# EAGLE design automatic_Slider_door_2 (EAGLE 9.6.2)
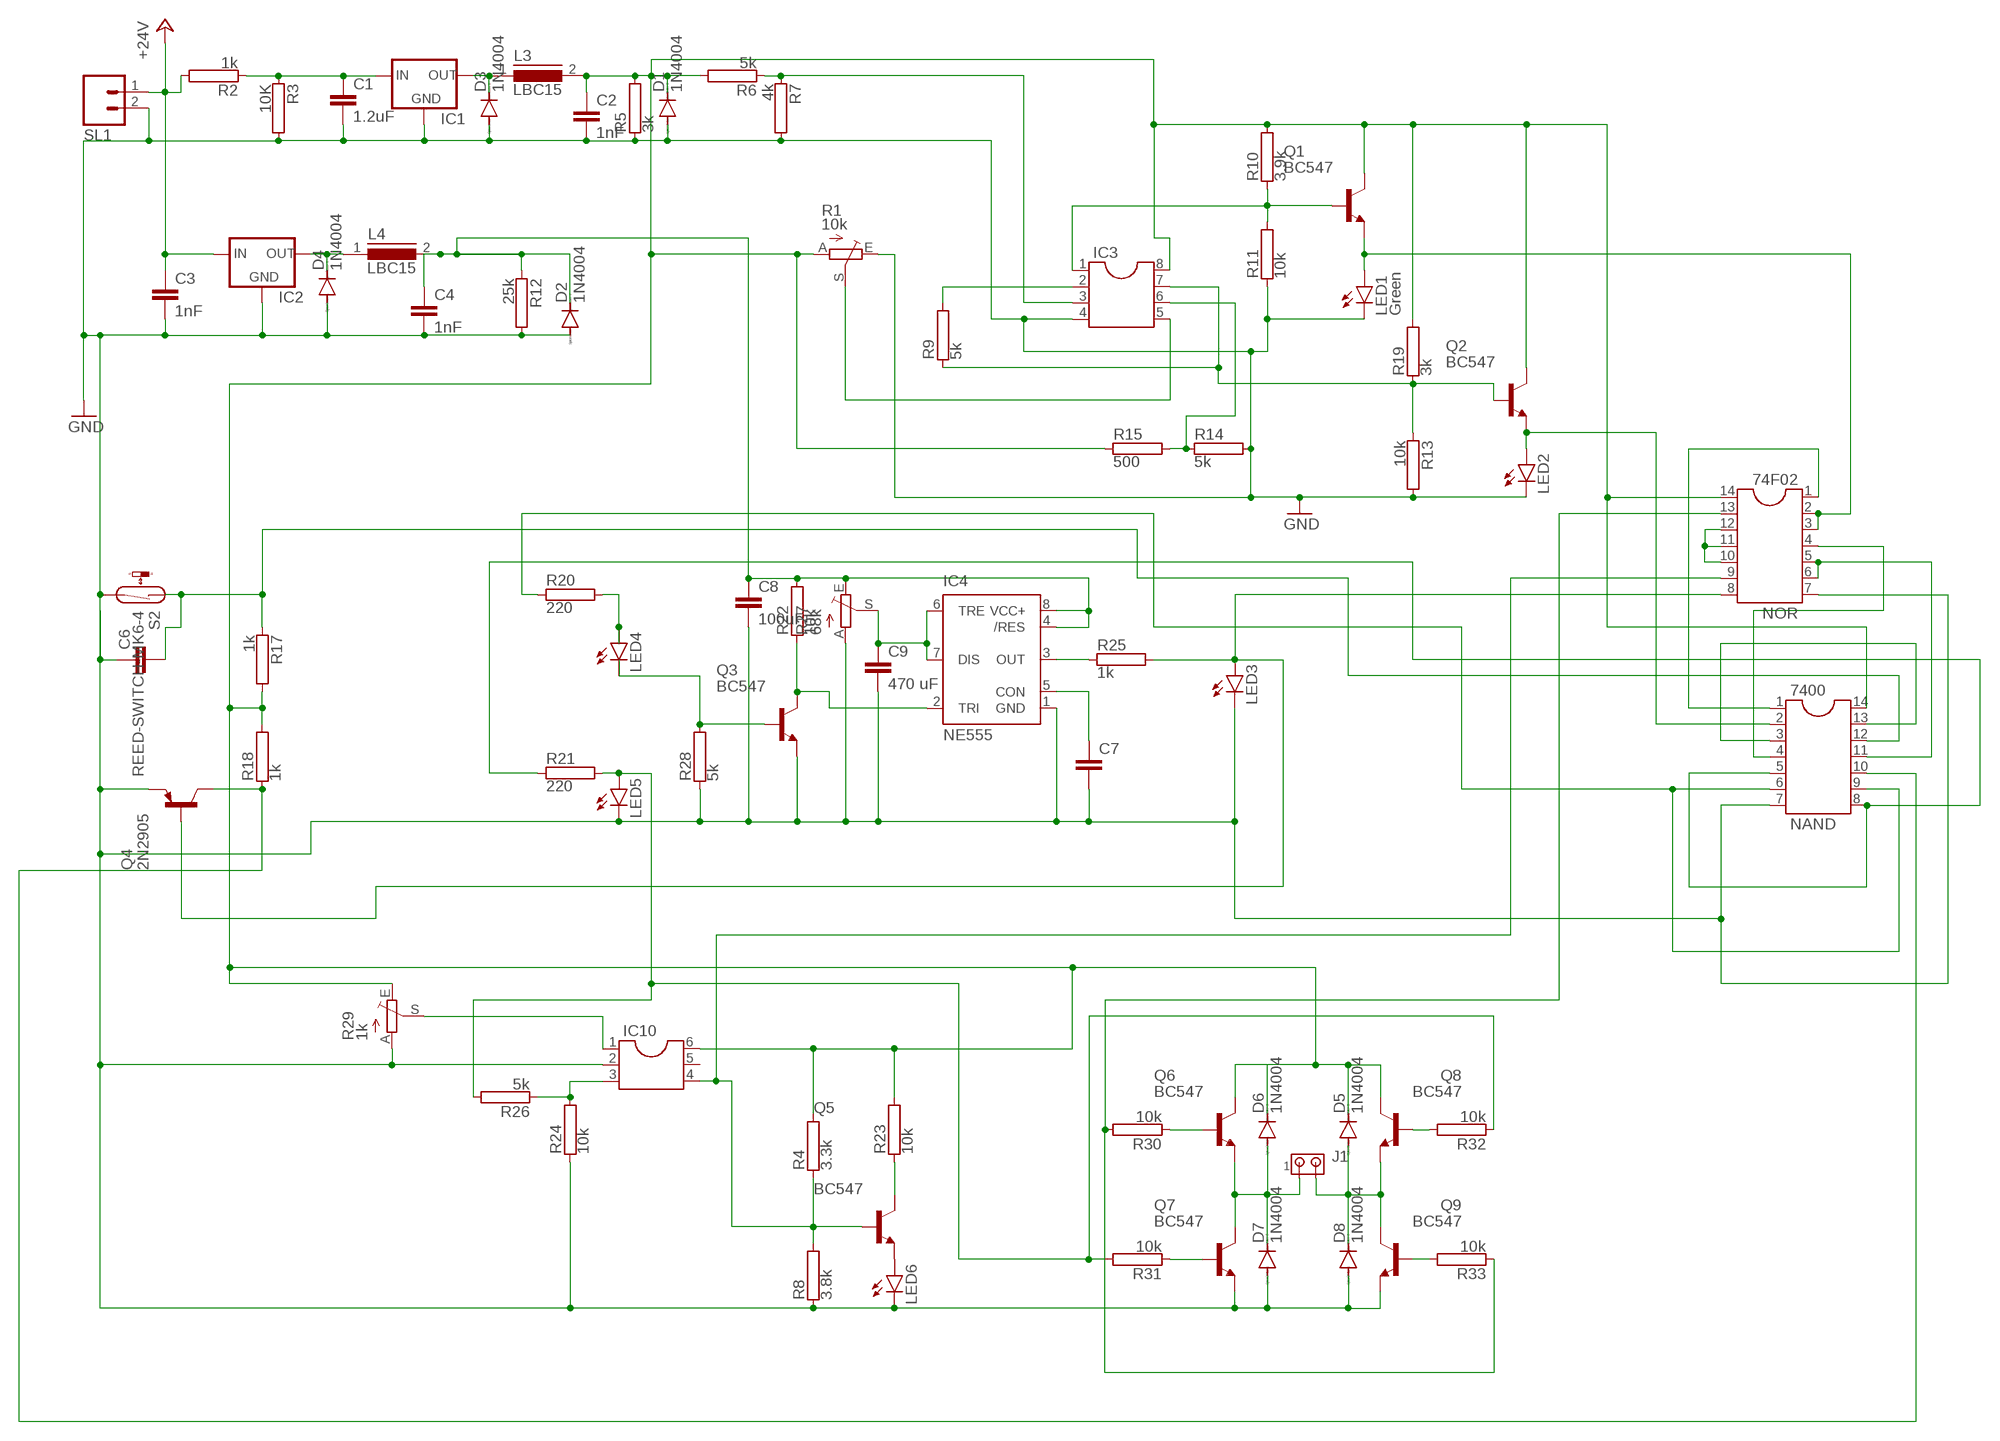
[diagram p0: schematic, sheet 1]

## Parts
74F02  NOR  DIL14  [DIL14]
7400  NAND  DIL14  [DIL14]
C1  1.2uF  C2,5-3  [C2.5-3]
C2  1nF  C2,5-3  [C2.5-3]
C3  1nF  C2,5-3  [C2.5-3]
C4  1nF  C2,5-3  [C2.5-3]
C6  C2,5-3  [C2.5-3]
C7  C2,5-3  [C2.5-3]
C8  100uF  C2,5-3  [C2.5-3]
C9  470 uF  C2,5-3  [C2.5-3]
D1  1N4004  [DO41-10]
D2  1N4004  [DO41-10]
D3  1N4004  [DO41-10]
D4  1N4004  [DO41-10]
D5  1N4004  [DO41-10]
D6  1N4004  [DO41-10]
D7  1N4004  [DO41-10]
D8  1N4004  [DO41-10]
IC1  78LXX  [78LXX]
IC2  78LXX  [78LXX]
IC3  DIL8S  [SOCKET-08]
IC4  NE555  [DIL-08]
IC10  DIL6S  [SOCKET-06]
J1  MTA02-156  [1X2MTA]
L3  LBC15  [LBC15]
L4  LBC15  [LBC15]
LED1  Green  LEDB152  [Q62902-B152]
LED2  LEDB152  [Q62902-B152]
LED3  LEDB152  [Q62902-B152]
LED4  LEDB152  [Q62902-B152]
LED5  LEDB152  [Q62902-B152]
LED6  LEDB152  [Q62902-B152]
Q1  BC547  [TO92]
Q2  BC547  [TO92]
Q3  BC547  [TO92]
Q4  2N2905  [TO5]
Q5  BC547  [TO92]
Q6  BC547  [TO92]
Q7  BC547  [TO92]
Q8  BC547  [TO92]
Q9  BC547  [TO92]
R1  10k  TRIM_EU-S75P  [S75P]
R2  1k  RCA0001  [CA0001]
R3  10K  RCA0001  [CA0001]
R4  3.3k  RCA0001  [CA0001]
R5  3k  RCA0001  [CA0001]
R6  5k  RCA0001  [CA0001]
R7  4k  RCA0001  [CA0001]
R8  3.8k  RCA0001  [CA0001]
R9  5k  RCA0001  [CA0001]
R10  3.9k  RCA0001  [CA0001]
R11  10k  RCA0001  [CA0001]
R12  25k  RCA0001  [CA0001]
R13  10k  RCA0001  [CA0001]
R14  5k  RCA0001  [CA0001]
R15  500  RCA0001  [CA0001]
R17  1k  RCA0001  [CA0001]
R18  1k  RCA0001  [CA0001]
R19  3k  RCA0001  [CA0001]
R20  220  RCA0001  [CA0001]
R21  220  RCA0001  [CA0001]
R22  10k  RCA0001  [CA0001]
R23  10k  RCA0001  [CA0001]
R24  10k  RCA0001  [CA0001]
R25  1k  RCA0001  [CA0001]
R26  5k  RCA0001  [CA0001]
R27  68k  TRIM_EU-S75P  [S75P]
R28  5k  RCA0001  [CA0001]
R29  1k  TRIM_EU-S75P  [S75P]
R30  10k  RCA0001  [CA0001]
R31  10k  RCA0001  [CA0001]
R32  10k  RCA0001  [CA0001]
R33  10k  RCA0001  [CA0001]
S2  REED-SWITCH-MK6-4  [MK6-4]
SL1  MA02  [02PA]

## Nets
+24V: C3.1 IC2.IN R2.2 SL1.1
GND: 74F02.7 7400.7 C1.2 C2.2 C3.2 C4.2 C6.1 C7.2 C8.2 C9.2 D1.A D2.A D3.A D4.A D7.A D8.A IC1.GND IC2.GND IC3.4 IC4.1(GND) IC10.2 LED1.K(C) LED2.K(C) LED3.K(C) LED5.K(C) LED6.K(C) Q3.1(E) Q4.1(E) Q7.1(E) Q9.1(E) R1.E R3.2 R5.1 R7.2 R8.1 R11.1 R12.2 R13.2 R14.2 R24.1 R27.A R28.1 R29.A S2.2 SL1.2
N$1: IC3.5 R1.S
N$2: C1.1 IC1.IN R2.1 R3.1
N$3: 7400.2 LED2.A Q2.1(E)
N$4: D3.C IC1.OUT L3.1
N$5: 7400.5 7400.8 R21.1
N$6: IC3.2 R9.2
N$7: IC3.6 R14.1 R15.2
N$8: IC3.7 Q2.2(B) R9.1 R13.1 R19.1
N$9: IC3.3 R6.1 R7.1
N$10: IC3.1 Q1.2(B) R10.1 R11.2
N$11: 7400.3 7400.13
N$14: 74F02.9 IC10.4 Q5.2(B) R4.1 R8.2
N$15: IC4.3(OUT) R25.1
N$16: Q9.2(B) R33.2
N$17: 7400.12 C6.2 R17.1 S2.1
N$18: 74F02.2 74F02.3 LED1.A Q1.1(E)
N$19: 74F02.5 74F02.6 7400.11
N$20: IC10.3 R24.2 R26.1
N$21: LED4.A R20.2
N$22: 7400.10 Q4.3(C) R18.1
N$23: LED6.A Q5.1(E)
N$24: C4.1 C8.1 D2.C IC4.4(/RES) IC4.8(VCC+) L4.2 R12.1 R22.2 R27.E
N$25: LED5.A R21.2 R26.2 R31.2 R32.1
N$26: C9.1 IC4.6(TRE) IC4.7(DIS) R27.S
N$27: IC4.2(TRI) Q3.3(C) R22.1
N$28: 74F02.4 7400.4
N$29: IC10.1 R29.S
N$30: 74F02.8 LED3.A Q4.2(B) R25.2
N$31: C7.1 IC4.5(CON)
N$32: LED4.K(C) Q3.2(B) R28.2
N$33: 74F02.10 74F02.11 74F02.12
N$35: 7400.6 7400.9 R20.1
N$38: 74F02.1 7400.1
N$39: D4.C IC2.OUT L4.1
N$40: 74F02.13 R30.2 R33.1
N$41: D6.A D7.C J1.1 Q6.1(E) Q7.3(C)
N$42: Q8.2(B) R32.2
N$43: 74F02.14 7400.14 C2.1 D1.C D5.C D6.C IC3.8 IC10.6 L3.2 Q1.3(C) Q2.3(C) Q6.3(C) Q8.3(C) R1.A R4.2 R5.2 R6.2 R10.2 R15.1 R17.2 R18.2 R19.2 R23.2 R29.E
N$45: Q5.3(C) R23.1
N$46: D5.A D8.C J1.2 Q8.1(E) Q9.3(C)
N$48: Q7.2(B) R31.1
N$49: Q6.2(B) R30.1
Unconnected: IC10.5

## Library data of the parts
74F02 7400 = ic-package:DIL14: Dual In Line / Socket
C1-C4 C6-C9 = capacitor-wima:C: CAPACITOR naming: grid - package width
D1-D8 = diode:1N4004: DIODE general purpose rectifier, 1 A
IC1 IC2 = v-reg:78LXX: VOLTAGE REGULATOR
IC3 = ic-package:DIL8: Dual In Line / Socket
IC4 = st-microelectronics:NE555: General purpose bipolar Timer; MF: Arrow Electronics; MPN: NE555N; OC_FARNELL: 1467742; OC_NEWARK: 89K1486
IC10 = ic-package:DIL6: Dual In Line / Socket
J1 = con-amp:MTA02-156: AMP connector
L3 L4 = inductors:LBC15: INDUCTOR; SPICEPREFIX: L
LED1-LED6 = led:LED: LED OSRAM: - CHIPLED LG R971, LG N971, LY N971, LG Q971, LY Q971, LO R971, LY R971 LH N974, LH R974 LS Q976, LO Q976, LY Q976 LO Q996 - Hyper CHIPLED LW Q18S LB Q993, LB Q99A, LB R99A - SideLED LS A670, LO A670, LY A670, LG A670, LP A670 LB A673, LV A673, LT A673, LW A673 LH A674 LY A675 LS A676, LA A676, LO A676, LY A676, LW A676 LS A679, LY A679, LG A679 - Hyper Micro SIDELED® LS Y876, LA Y876, LO Y876, LY Y876 LT Y87S - SmartLED LW L88C, LW L88S LB L89C, LB L89S, LG L890 LS L89K, LO L89K, LY L89K LS L896, LA L896, LO L896, LY L896 - TOPLED LS T670, LO T670, LY T670, LG T670, LP T670 LSG T670, LSP T670, LSY T670, LOP T670, LYG T670 LG T671, LOG T671, LSG T671 LB T673, LV T673, LT T673, LW T673 LH T674 LS T676, LA T676, LO T676, LY T676, LB T676, LH T676, LSB T676, LW T676 LB T67C, LV T67C, LT T67C, LS T67K, LO T67K, LY T67K, LW E67C LS E67B, LA E67B, LO E67B, LY E67B, LB E67C, LV E67C, LT E67C LW T67C LS T679, LY T679, LG T679 LS T770, LO T770, LY T770, LG T770, LP T770 LB T773, LV T773, LT T773, LW T773 LH T774 LS E675, LA E675, LY E675, LS T675 LS T776, LA T776, LO T776, LY T776, LB T776 LHGB T686 LT T68C, LB T68C - Hyper Mini TOPLED® LB M676 - Mini TOPLED Santana® LG M470 LS M47K, LO M47K, LY M47K Source: http://www.osram.convergy.de LUXEON: - LUMILED® LXK2-PW12-R00, LXK2-PW12-S00, LXK2-PW14-U00, LXK2-PW14-V00 LXK2-PM12-R00, LXK2-PM12-S00, LXK2-PM14-U00 LXK2-PE12-Q00, LXK2-PE12-R00, LXK2-PE12-S00, LXK2-PE14-T00, LXK2-PE14-U00 LXK2-PB12-K00, LXK2-PB12-L00, LXK2-PB12-M00, LXK2-PB14-N00, LXK2-PB14-P00, LXK2-PB14-Q00 LXK2-PR12-L00, LXK2-PR12-M00, LXK2-PR14-Q00, LXK2-PR14-R00 LXK2-PD12-Q00, LXK2-PD12-R00, LXK2-PD12-S00 LXK2-PH12-R00, LXK2-PH12-S00 LXK2-PL12-P00, LXK2-PL12-Q00, LXK2-PL12-R00 Source: www.luxeon.com KINGBRIGHT: KA-3528ASYC Source: www.kingbright.com
Q1-Q3 Q5-Q9 = transistor-npn:BC547*: NPN Transistor
Q4 = transistor-pnp:2N2905: PNP Transistor
R1 R27 R29 = pot:TRIM_EU-: POTENTIOMETER
R2-R15 R17-R26 R28 R30-R33 = resistor-power:R: Power Resitor; OC_FARNELL: unknown; OC_NEWARK: unknown
S2 = switch-reed:REED-SWITCH-: Reed Sensor; OC_FARNELL: unknown
SL1 = con-amp-quick:MA02: AMP QUICK CONNECTOR; OC_FARNELL: unknown; OC_NEWARK: unknown

## Net classes
0 default: width 0.305 mm, drill 0.508 mm, clearance 0.254 mm

## Board
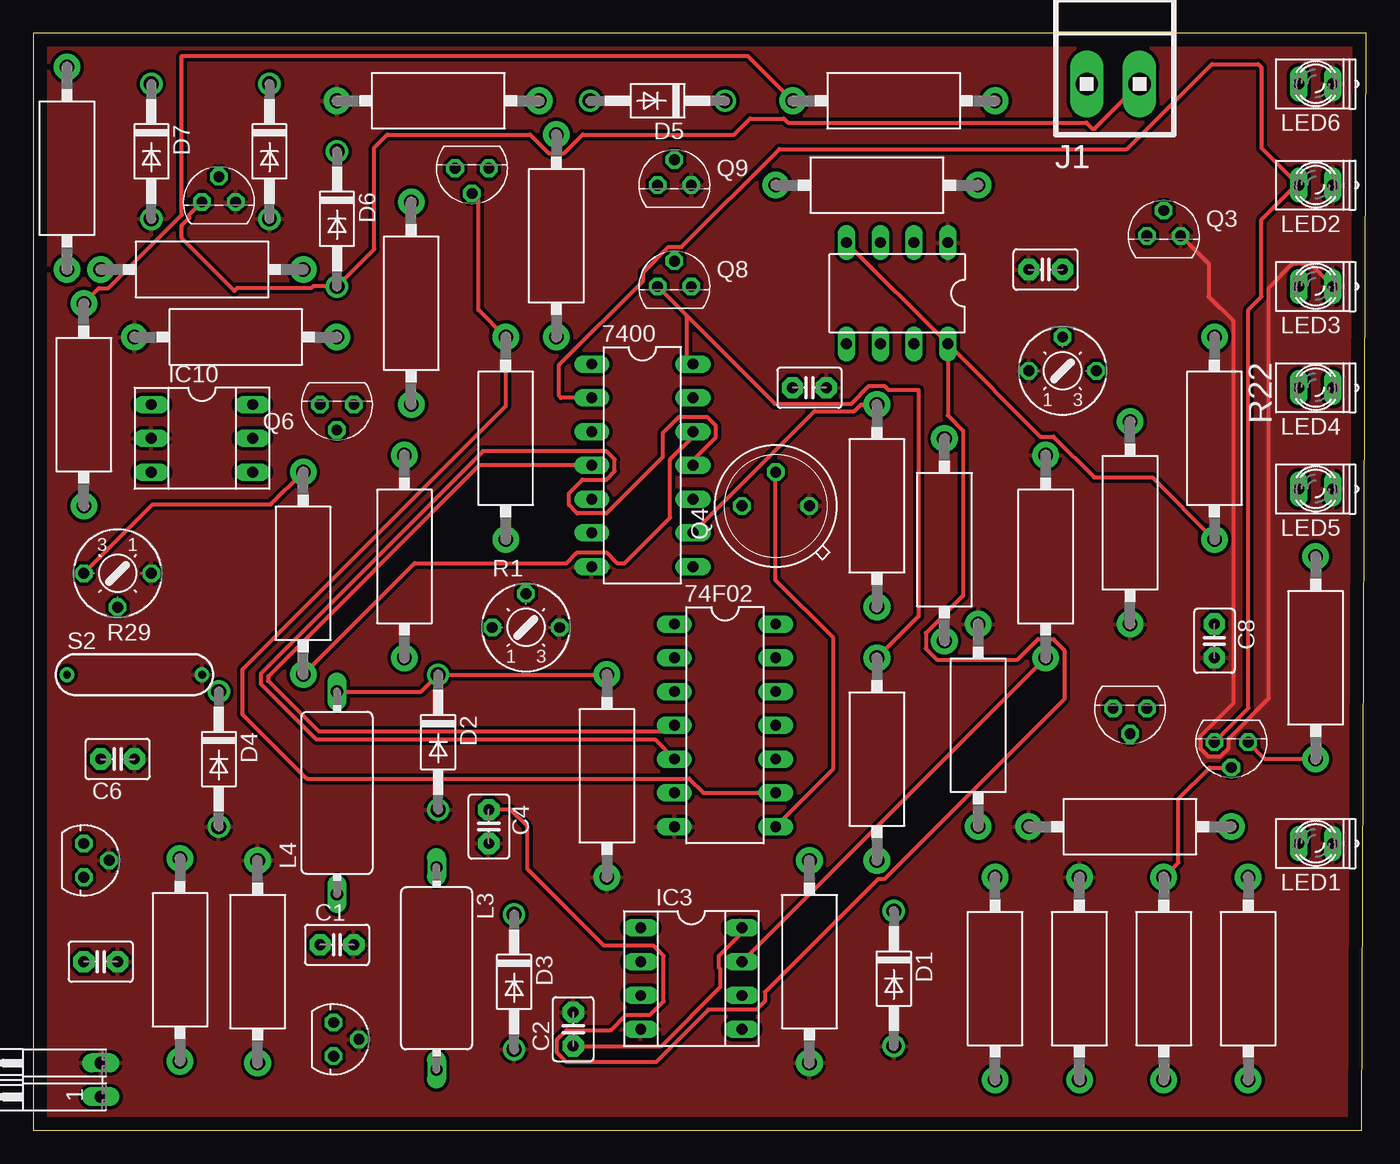
[diagram p1: board, top side]
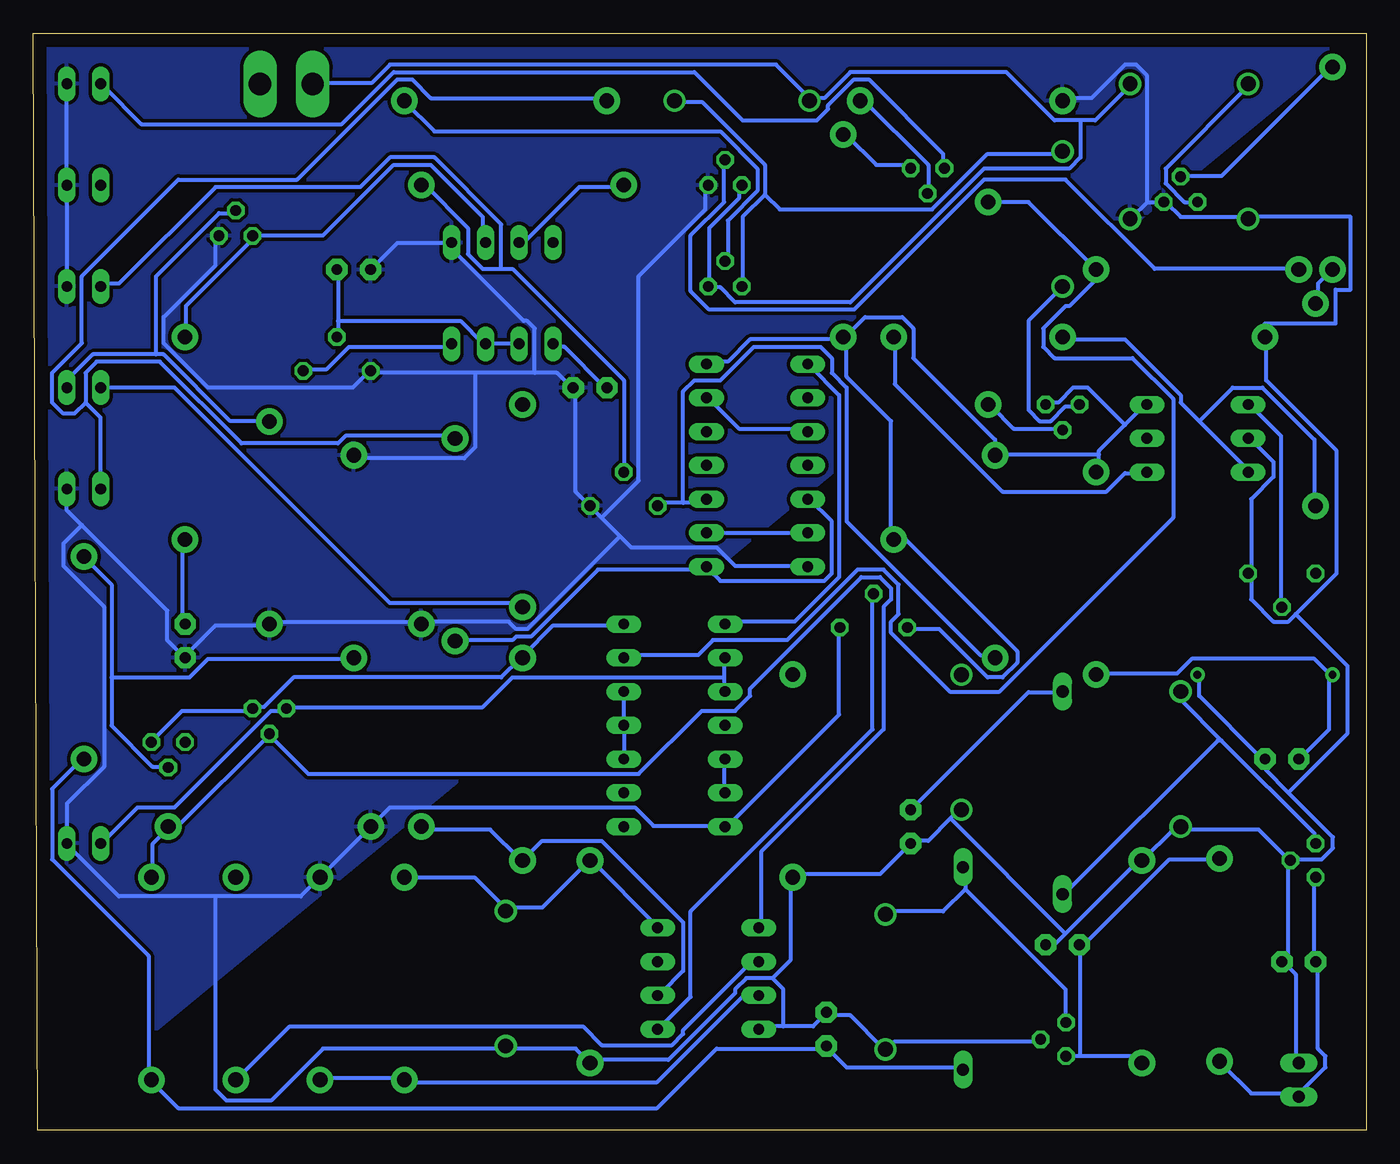
[diagram p2: board, bottom side, seen from below]

Size 100.33 x 82.55 mm. Coordinates in mm from the lower left corner, seen from the top.
Outline: 0,0 100,0 100.33,82.55 0,82.54 0,0
Copper layers (1*16): Top 0.035mm / dielectric 1.5mm / Bottom 0.035mm
Design rules "default": minimum track width 6mil, minimum drill 0.35mm, track to track 6mil, track to pad 6mil, pad to pad 6mil, via to via 6mil, smd to smd 6mil, copper to edge 40mil, drill to drill 6mil, minimum pad ring 10mil, minimum via ring 8mil, stop-mask expansion 4mil, vias tented up to drill 0mil, thermal gap 10mil

### Footprints (pad centres in the part's own frame; a part is rotated, then mirrored left to right if it is on the bottom)
DIL14 = drill 0.813 long: 1 -7.62,-3.81; 2 -5.08,-3.81; 3 -2.54,-3.81; 4 0,-3.81; 5 2.54,-3.81; 6 5.08,-3.81; 7 7.62,-3.81; 8 7.62,3.81; 9 5.08,3.81; 10 2.54,3.81; 11 0,3.81; 12 -2.54,3.81; 13 -5.08,3.81; 14 -7.62,3.81
C2.5-3 = drill 0.813 pad 1.6 octagon: 1 -1.27,0; 2 1.27,0
DO41-10 = drill 1.118: A 5.08,0; C -5.08,0
78LXX = drill 0.813 octagon: GND 0,1.905; IN 1.27,0; OUT -1.27,0
SOCKET-08 = drill 0.813 long: 1 -3.81,-3.81; 2 -1.27,-3.81; 3 1.27,-3.81; 4 3.81,-3.81; 5 3.81,3.81; 6 1.27,3.81; 7 -1.27,3.81; 8 -3.81,3.81
DIL-08 = drill 0.813 long: 1 -3.81,-3.81; 2 -1.27,-3.81; 3 1.27,-3.81; 4 3.81,-3.81; 5 3.81,3.81; 6 1.27,3.81; 7 -1.27,3.81; 8 -3.81,3.81
SOCKET-06 = drill 0.813 long: 1 -2.54,-3.81; 2 0,-3.81; 3 2.54,-3.81; 4 2.54,3.81; 5 0,3.81; 6 -2.54,3.81
1X2MTA = drill 1.676 long: 1 1.981,0; 2 -1.981,0
LBC15 = drill 0.914 long: 1 -7.62,0; 2 7.62,0
Q62902-B152 = drill 0.813 long: A 1.27,0; K -1.27,0
TO92 = drill 0.813 octagon: 1 1.27,0; 2 0,1.905; 3 -1.27,0
TO5 = drill 0.813 octagon: 1 0,-2.54; 2 2.54,0; 3 0,2.54
S75P = drill 0.813 octagon: A -2.54,0; E 2.54,0; S 0,2.54
CA0001 = drill 1.1 pad 2: 1 -7.62,0; 2 7.62,0
MK6-4 = drill 0.6 pad 1.016: 1 -5.08,0; 2 5.08,0
02PA = drill 0.914 long: 1 -1.27,0; 2 1.27,0

### Placement (x,y rotation side)
74F02  52.07,30.48 270 top
7400  45.85,50.04 270 top
C1  22.86,13.97 0 top
C2  40.64,7.62 90 top
C3  5.08,12.7 0 top
C4  34.29,22.86 270 top
C6  6.35,27.94 180 top
C7  58.42,55.88 0 top
C8  88.9,36.83 270 top
C9  76.2,64.77 180 top
D1  64.77,11.43 270 top
D2  30.48,29.21 270 top
D3  36.2,11.18 270 top
D4  13.97,27.94 270 top
D5  46.99,77.47 180 top
D6  22.86,68.58 270 top
D7  8.89,73.66 270 top
D8  17.78,73.66 270 top
IC1  22.61,6.86 270 top
IC2  3.81,20.32 270 top
IC3  49.53,11.43 270 top
IC4  65.02,62.99 180 top
IC10  12.7,52.07 270 top
J1  81.28,78.74 0 top
L3  30.35,12.19 270 top
L4  22.86,25.4 90 top
LED1  96.52,21.59 180 top
LED2  96.52,71.12 180 top
LED3  96.52,63.5 180 top
LED4  96.52,55.88 180 top
LED5  96.52,48.26 180 top
LED6  96.52,78.74 180 top
Q1  82.55,31.75 180 top
Q2  90.17,29.21 180 top
Q3  85.09,67.31 0 top
Q4  55.88,46.99 90 top
Q5  33.02,72.39 180 top
Q6  22.86,54.61 180 top
Q7  13.97,69.85 0 top
Q8  48.26,63.5 0 top
Q9  48.26,71.12 0 top
R1  37.08,37.85 0 top
R2  11.05,12.83 270 top
R3  16.89,12.7 90 top
R4  35.56,52.07 270 top
R5  58.42,12.7 90 top
R6  72.39,11.43 90 top
R7  78.74,11.43 90 top
R8  30.48,77.47 0 top
R9  85.09,11.43 270 top
R10  91.44,11.43 270 top
R11  82.55,22.86 0 top
R12  43.18,26.67 270 top
R13  76.2,43.18 90 top
R14  71.12,30.48 90 top
R15  63.5,27.94 270 top
R17  20.32,41.91 90 top
R18  27.94,43.18 90 top
R19  96.52,35.56 270 top
R20  63.5,46.99 270 top
R21  68.58,44.45 90 top
R22  88.9,52.07 270 top
R23  39.37,67.31 270 top
R24  15.24,59.69 0 top
R25  63.5,71.12 0 top
R26  3.81,54.61 90 top
R27  77.47,57.15 0 top
R28  82.55,45.72 90 top
R29  6.35,41.91 180 top
R30  28.45,62.23 90 top
R31  2.54,72.39 270 top
R32  64.77,77.47 0 top
R33  12.7,64.77 180 top
S2  7.62,34.29 0 top
SL1  5.08,3.81 90 top

### Tracks (layer width: path | path; a pad name or v marks a point on that pad's centre or on a via)
+24V
  Bottom 0.305: IC2.IN 3.91,19 3.91,12.85 C3.1 3.63,12.57 3.63,6.15 3.07,5.59 3.07,4.75 5.03,2.79 SL1.1 5.31,2.79 8.66,2.79 10.9,5.03 R2.2
GND
  Top 0.305: Q3.1 88.47,65.2 88.47,62.74 90.31,60.91 90.31,32.12 87.83,29.65 87.83,28.77 88.46,28.14 89.34,28.14 89.97,28.77 89.97,29.49 93,32.52 93,63.42 94.81,65.23 96.06,65.23 LED3.K
  Bottom 0.305: R1.E 39.67,37.72 39.67,31.29 48.06,22.91 74F02.7 48.34,22.91 53.65,22.91 55.04,24.31 73.48,24.31 R11.1 R7.2 80.19,17.6 86.61,17.6 | 86.61,17.6 93.88,17.6 97.79,21.51 LED1.K 97.79,24.59 95,27.38 95,39.4 98.07,42.47 98.07,44.15 96.67,45.54 | C9.2 72.92,66.78 69.01,66.78 IC4.1 68.73,66.78 68.73,66.22 63.42,60.91 63.14,60.91 62.59,60.35 62.59,57 | 62.59,57 60.91,57 59.79,55.88 C7.2 59.51,55.88 59.51,48.06 58.67,47.22 Q4.1 58.4,46.94 57.56,46.1 | 62.59,57 67.06,57 | 67.06,57 74.88,57 R27.A 75.16,57 76.28,55.88 87.17,55.88 90.53,59.23 90.53,61.19 86.61,65.1 86.61,67.06 Q3.1 | 67.06,57 67.06,51.41 67.89,50.57 76,50.57 R13.2 | LED5.K 97.79,46.66 96.67,45.54 | 96.67,45.54 90.25,39.12 90.25,36.88 89.13,35.76 C8.2 88.85,35.76 86.61,38 82.7,38 R28.1 82.42,38.28 71.25,38.28 R14.2 70.97,38.28 64.54,38.28 63.98,37.72 63.14,37.72 56.16,44.7 | 57.56,46.1 56.16,44.7 | 56.16,44.7 55.32,43.87 48.9,43.87 47.5,42.47 42.19,42.47 7400.7 | 57.56,46.1 54.76,48.9 54.76,64.26 49.73,69.29 49.73,70.97 Q9.1 | 31.29,23.47 30.73,24.03 D2.A | 31.29,23.47 32.97,21.79 34.09,21.79 C4.2 36.6,19.28 43.03,19.28 R12.2 43.31,19 43.31,12.85 44.7,11.46 | 43.87,7.82 41.63,7.82 40.79,8.66 C2.2 40.51,8.66 38.84,8.66 36.32,6.15 D3.A 36.04,6.15 35.48,6.71 24.59,6.71 IC1.GND | 43.87,7.82 45.54,7.82 IC3.4 | 44.7,11.46 46.66,11.46 47.5,10.62 47.5,10.34 52.53,5.31 58.4,5.31 R5.1 58.67,5.31 59.51,6.15 64.54,6.15 D1.A 64.82,6.15 78.51,6.15 82.42,2.23 85.78,2.23 86.61,3.07 86.61,17.6 | 44.7,11.46 43.87,10.62 43.87,7.82 | 8.66,41.91 8.66,47.5 6.99,49.17 6.99,50.29 8.66,51.97 IC10.2 | 5.31,38.84 5.87,38.28 6.99,38.28 8.66,39.95 8.66,41.91
  Bottom 0.305: 5.31,38.84 2.23,41.91 2.23,51.13 7.54,56.44 7.54,59.51 R24.1 7.62,60.72 2.3,60.72 2.3,63.26 1.17,63.26 1.17,68.73 8.94,68.73 | 8.66,41.91 R29.A | C1.2 23.47,13.97 22.63,14.81 | 22.63,14.81 17.04,20.4 R3.2 16.76,20.4 14.53,22.63 13.97,22.63 | S2.2 12.57,34.09 12.57,32.69 7.82,27.94 C6.1 7.54,27.94 7.54,27.1 5.87,25.43 | IC2.GND 5.87,20.12 5.87,13.13 6.15,12.85 C3.2 6.15,12.57 5.31,11.73 5.31,5.31 SL1.2 | 5.87,25.43 2.52,22.07 2.52,21.23 3.35,20.4 5.59,20.4 IC2.GND | 13.97,22.63 8.1,22.63 5.87,20.4 IC2.GND | 13.97,22.63 D4.A | 5.31,38.84 1.4,34.92 1.4,29.9 5.87,25.43 | 22.63,14.81 31.29,23.47 | 16.48,69.85 Q7.1 15.09,69.85 13.97,68.73 9.58,68.73 8.94,68.73 | 16.48,69.85 17.6,68.73 D8.A | 8.94,68.73 D7.A | 16.48,69.85 16.48,79.35 17.32,80.19 18.16,80.19 20.68,77.67 22.63,77.67 R8.1 | LED3.K LED2.K LED6.K
  pour Top: 0,0 0,82.57 100.23,82.57 100.23,-0.01 100.23,-0.03 -0.01,-0.03 -0.03,-0.03 -0.03,-0.01
  pour Bottom: 0,82.63 100.27,82.63 100.27,0
N$1
  Bottom 0.305: R1.S 37.16,40.23 37.16,30.18 50.85,16.48 50.85,10.06 53.09,7.82 IC3.5
N$2
  Bottom 0.305: 21.51,5.59 17.32,5.59 17.04,5.31 R3.1 | 21.51,5.59 IC1.IN | 21.51,5.59 21.51,13.69 | 21.51,13.69 21.51,13.97 C1.1 21.51,13.69 | 21.51,13.69 14.81,20.4 11.18,20.4 R2.1
N$3
  Top 0.305: 7400.2 39.73,55.12 39.59,55.26 39.59,57.61 45.92,63.94 45.92,64.58 47.82,66.47 48.8,66.47 56.15,73.82 82.32,73.82 88.71,80.22 92.2,80.22 92.44,79.98 92.44,73.93 95.14,71.23 | 95.14,71.23 LED2.A | Q2.1 91.46,31.77 91.46,61.76 92.44,62.74 92.44,68.53 95.14,71.23
N$4
  Bottom 0.305: 30.18,18.16 22.63,10.62 22.63,8.38 IC1.OUT | 30.18,18.16 30.18,19.56 L3.1 | 30.18,18.16 31.85,16.48 36.04,16.48 D3.C
N$5
  Bottom 0.305: 7400.5 41.91,47.5 40.23,45.82 40.23,41.91 40.79,41.35 48.62,41.35 49.45,42.19 7400.8 49.73,42.19 57.84,42.19 62.87,37.16 63.98,37.16 64.26,36.88 68.45,36.88 R21.1
N$6
  Bottom 0.305: IC3.2 45.82,12.57 46.38,12.57 51.41,7.54 51.41,7.26 52.25,6.43 57.56,6.43 58.95,7.82 81.03,7.82 84.94,3.91 R9.2
N$7
  Bottom 0.305: IC3.6 53.09,10.34 51.41,12.01 51.41,15.65 57.56,21.79 62.03,21.79 R15.2 63.7,20.4 65.94,22.63 70.97,22.63 R14.1
N$8
  Top 0.305: IC3.7 R13.1 | R9.1 86.19,20.15 86.19,24.95 88.54,27.3 Q2.2
  Bottom 0.305: 94.44,34.09 94.44,41.07 96.39,43.03 R19.1 | 94.44,34.09 94.44,30.45 91.36,27.38 90.25,27.38 Q2.2 | 94.44,34.09 88.57,34.09 87.17,35.48 76.28,35.48 R13.1
N$9
  Bottom 0.305: IC3.3 45.82,10.06 46.94,10.06 53.37,3.63 72.36,3.63 R6.1 72.64,3.91 78.51,3.91 R7.1
N$10
  Bottom 0.305: R10.1 91.36,19.28 91.36,21.51 90.25,22.63 R11.2 89.97,22.91 89.41,22.91 82.7,29.62 Q1.2 82.42,29.62 79.63,26.82 54.76,26.82 50.01,31.57 47.5,31.57 46.38,32.69 46.38,33.25 38,41.63 36.6,41.63 35.76,40.79 35.76,39.95 36.32,39.4 36.32,30.18 45.54,20.95 45.54,15.37 IC3.1
N$11
  Bottom 0.305: 7400.3 42.19,52.81 47.22,52.81 49.45,55.04 7400.13
N$14
  Top 0.305: Q5.2 33.51,69.99 33.51,61.74 R4.1 35.56,54.49 15.74,34.67 15.74,31.3 20.58,26.47 49.36,26.47 50.43,25.4 74F02.9
  Bottom 0.305: IC10.4 16.76,49.45 18.16,49.45 19.56,48.06 27.38,48.06 35.48,56.16 35.48,59.51 R4.1 | Q5.2 32.97,70.69 32.97,72.64 38,77.67 R8.2
N$15
  Bottom 0.305: IC4.3 63.7,67.06 63.14,67.06 59.23,70.97 55.88,70.97 R25.1
N$16
  Bottom 0.305: Q9.2 48.34,72.92 48.34,69.85 50.85,67.33 50.85,63.14 49.45,61.75 38.56,61.75 28.78,71.53 22.63,71.53 15.93,64.82 5.31,64.82 R33.2
N$17
  Top 0.305: R17.1 28.71,42.68 40.13,42.68 40.94,43.48 43.14,43.48 43.95,42.68 44.5,42.68 47.93,46.11 47.93,50.48 49.66,52.21 7400.12
  Bottom 0.305: C6.2 5.03,27.94 2.79,30.18 2.79,34.09 S2.1 2.79,34.37 3.91,35.48 13.13,35.48 14.25,34.37 20.12,34.37 R17.1
N$18
  Bottom 0.305: 48.34,34.09 48.34,35.48 74F02.2 | 48.34,34.09 48.34,33.25 74F02.3 | LED1.A 95,21.79 92.48,24.31 89.69,24.31 82.42,31.57 81.31,31.57 Q1.1 81.03,31.85 66.5,31.85 64.26,34.09 48.34,34.09
N$19
  Top 0.305: 7400.11 49.66,50.41 51.38,52.14 51.38,53.02 50.76,53.65 48.55,53.65 47.37,52.46 47.37,50.66 43.14,46.43 40.94,46.43 40.31,47.06 40.31,47.94 41.34,48.97 43.14,48.97 43.76,49.6 43.76,50.48 43.14,51.1 33.85,51.1 17.12,34.37 17.12,33.6 21.31,29.41 46.79,29.41 74F02.5
  Bottom 0.305: 74F02.6 48.34,25.43 48.34,27.94 74F02.5
N$20
  Bottom 0.305: 12.57,53.37 13.97,54.76 13.97,55.32 18.16,59.51 22.63,59.51 R24.2 | 12.57,53.37 8.94,49.73 IC10.3 | 12.57,53.37 10.06,55.88 7.82,55.88 3.91,51.97 3.91,47.22 R26.1
N$21
  Bottom 0.305: LED4.A 89.69,55.88 73.48,39.67 63.98,39.67 63.7,39.4 R20.2
N$22
  Bottom 0.305: 51.41,47.22 50.01,47.22 49.73,47.5 7400.10 | 51.41,47.22 53.09,47.22 Q4.3 | 51.41,47.22 51.41,55.6 50.57,56.44 48.62,56.44 46.1,58.95 41.07,58.95 40.23,58.12 40.23,57 39.12,55.88 39.12,45.82 29.06,35.76 27.94,35.76 R18.1
N$23
  Bottom 0.305: Q5.1 31.85,72.64 31.85,73.48 37.44,79.07 38.56,79.07 40.51,77.11 40.51,76.83 41.35,76 46.94,76 50.57,79.63 73.2,79.63 77.11,75.72 92.2,75.72 95,78.51 LED6.A
N$24
  Top 0.305: L4.2 29.21,33.02 D2.C R12.1 | R22.2 84.22,49.13 79.86,49.13 76.78,52.21 75.81,52.21 IC4.8 | IC4.8 IC4.4 | IC4.8 68.83,53.8 69.99,52.65 69.99,40.23 67.17,37.41 67.17,36.25 68,35.42 74.08,35.42 75.62,36.97 76.78,36.97 77.61,36.14 77.61,32.44 64.08,18.91 63.58,18.91 55.07,10.4 55.07,9.72 54.44,9.09 50.81,9.09 46.86,5.14 40.14,5.14 39.43,5.85 39.43,6.85 40.14,7.56 43.49,7.56 44.62,8.69 46.42,8.69 47.45,9.72 47.45,13.14 46.68,13.91 42.95,13.91 37.2,19.66 37.2,22.88 35.94,24.13 C4.1
  Bottom 0.305: L4.2 22.91,32.97 25.43,32.97 34.09,24.31 C4.1 | C8.1 89.13,38.28 89.13,44.42 R22.2 | IC4.8 69.01,58.95 76.56,58.95 78.23,57.28 79.91,57.28 R27.E
N$25
  Top 0.305: R26.2 4.94,63.36 5.66,63.36 11.19,68.89 11.19,80.85 53.77,80.85 R32.1
  Bottom 0.305: 96.39,54.76 95.28,53.65 95.28,48.34 LED5.A | 96.39,54.76 96.39,57 95.56,57.84 90.81,57.84 84.66,51.69 77.39,51.69 76.83,52.25 68.73,52.25 R21.2 | 96.39,54.76 97.23,53.92 98.07,53.92 98.91,54.76 98.91,57 96.67,59.23 96.67,64.26 89.41,71.53 80.47,71.53 72.92,79.07 71.81,79.07 70.41,77.67 57.28,77.67 R32.1 | R26.2 3.63,62.31 3.63,63.7 2.79,64.54 R31.2
N$26
  Bottom 0.305: IC4.6 63.98,59.23 66.22,59.23 IC4.7 66.5,59.23 68.17,60.91 77.39,60.91 | 77.39,60.91 77.39,64.54 C9.1 | 77.39,60.91 77.39,59.79 R27.S
N$27
  Bottom 0.305: IC4.2 66.5,67.06 66.5,68.73 70.41,72.64 73.2,72.64 78.51,67.33 83.82,67.33 Q3.3 83.82,67.06 88.85,62.03 88.85,59.79 R22.1
N$28
  Top 0.305: 7400.4 33.57,50.04 17.68,34.14 17.68,33.83 21.48,30.03 47.81,30.03 74F02.4
N$29
  Bottom 0.305: R29.S 6.43,39.4 6.43,52.25 8.66,54.48 IC10.1
N$30
  Top 0.305: 74F02.8 60.22,27.2 60.22,37.06 55.88,41.41 Q4.2
  Bottom 0.305: Q4.2 55.88,56.44 64.26,64.82 65.1,64.82 | 65.1,64.82 66.5,64.82 67.61,65.94 67.61,67.89 70.97,71.25 R25.2 | 65.1,64.82 65.1,68.17 70.13,73.2 73.48,73.2 75.72,70.97 86.61,70.97 93.88,63.7 95,63.7 LED3.A
N$31
  Bottom 0.305: IC4.5 61.19,58.95 60.35,58.95 57.28,55.88 C7.1
N$32
  Bottom 0.305: LED4.K 97.79,56.44 95.83,58.4 91.08,58.4 | 91.08,58.4 90.53,58.4 85.5,53.37 82.7,53.37 R28.2 | 91.08,58.4 91.08,64.26 86.33,69.01 85.22,69.01 Q3.2
N$33
  Bottom 0.305: 74F02.10 74F02.11 74F02.12
N$35
  Top 0.305: 7400.9 58.81,54.12 61.81,54.12 62.3,54.61 R20.1
  Bottom 0.305: 7400.6 42.19,44.98 49.45,44.98 7400.9
N$38
  Bottom 0.305: 74F02.1 48.06,38.28 43.03,38.28 39.67,41.63 39.67,55.32 41.91,57.56 7400.1
N$39
  Bottom 0.305: 10.9,29.34 13.97,32.41 D4.C | 10.9,29.34 3.91,22.35 3.91,21.79 IC2.OUT | 10.9,29.34 11.18,29.34 22.63,17.88 L4.1
N$40
  Bottom 0.305: 74F02.13 55.88,35.76 50.29,35.76 49.17,36.88 43.59,36.88 38.28,42.19 36.32,42.19 35.2,41.07 35.2,38.84 35.76,38.28 35.76,37.44 31.29,32.97 27.66,32.97 14.53,46.1 14.53,55.04 17.6,58.12 23.47,58.12 24.31,58.95 24.31,60.35 22.63,62.03 22.35,62.03 20.4,63.98 20.4,64.54 R33.1 20.4,64.82 25.43,69.85 R30.2
N$41
  Top 0.305: Q7.3 11.74,68.89 11.74,68.66 11.18,68.09 11.18,67.12 15.13,63.16 15.33,63.36 20.9,63.36 21.04,63.5 D6.A 25.66,66.3 25.66,73.93 26.64,74.92 37.39,74.92 38.79,73.52 39.95,73.52 41.35,74.92 52.75,74.92 53.95,76.13 56.5,76.13 56.81,75.82 79.27,75.82 79.73,75.36 79.88,75.36 J1.1
  Bottom 0.305: Q6.1 21.79,54.48 22.63,54.48 23.75,53.37 24.59,53.37 25.43,54.2 25.43,60.91 22.91,63.42 D6.A | Q7.3 13.69,69.85 15.09,71.25 15.09,72.36 8.94,78.51 D7.C
N$42
  Bottom 0.305: Q8.2 48.06,65.66 48.06,68.45 45.82,70.69 45.82,72.36 48.62,75.16 70.13,75.16 72.36,77.39 R32.2
N$43
  Top 0.305: R29.E 9,47.1 17.89,47.1 R17.2 | C2.1 47.28,6.35 51.73,10.79 51.73,12.15 51.61,12.26 51.61,13.14 53.19,14.72 53.19,15.81 53.34,15.66 IC3.8 | R15.1 66.62,38.68 66.62,55.72 64.38,55.72 64.08,56.02 62.92,56.02 61.58,54.67 55.82,54.67 Q8.3 49.16,61.33 49.16,58.15 7400.14 | R19.2 92.71,27.94 Q2.3
  Bottom 0.305: L3.2 30.45,4.75 39.12,4.75 40.51,6.15 C2.1 40.79,6.15 48.9,6.15 53.37,1.68 89.41,1.68 91.36,3.63 R10.2 91.64,3.91 91.64,13.13 98.91,20.4 98.91,25.7 96.67,27.94 R19.2 | IC3.8 53.37,15.37 58.4,20.4 R5.2 58.67,20.12 62.03,16.76 64.54,16.76 D1.C 64.82,16.76 67.06,19 72.36,19 R6.2 | 18.16,53.09 20.12,51.13 20.12,50.85 | 18.16,53.09 16.76,54.48 IC10.6 | 20.12,50.85 20.12,49.73 R17.2 | 18.16,53.09 20.95,55.88 22.07,55.88 23.19,54.76 24.03,54.76 Q6.3 | 20.12,50.85 27.94,50.85 | 7400.14 49.45,57.84 48.06,57.84 46.38,59.51 39.4,59.51 R23.2 | R1.A 34.37,37.72 32.13,37.72 28.5,34.09 27.38,34.09 26.26,35.2 26.26,36.04 34.65,44.42 35.48,44.42 R4.2 35.76,44.7 35.76,53.37 39.12,56.72 39.12,59.51 R23.2 | 27.94,50.85 27.94,51.97 34.09,58.12 34.09,60.35 34.92,61.19 37.72,61.19 39.12,59.79 R23.2 | 27.94,50.85 R18.2 | 45.26,70.41 46.94,68.73 46.94,63.7 Q8.3 | 45.26,70.41 45.26,72.64 50.01,77.39 51.97,77.39 D5.C | 45.26,70.41 44.15,69.29 32.69,69.29 28.5,73.48 22.91,73.48 D6.C | Q2.3 91.36,29.34 89.13,31.57 83.82,31.57 Q1.3 83.82,31.85 82.98,31.85 80.75,34.09 65.1,34.09 63.7,35.48 R15.1 63.42,35.76 61.19,38 55.88,38 74F02.14
N$45
  Bottom 0.305: Q5.3 34.37,72.64 36.88,72.64 39.12,74.88 R23.1
N$46
  Bottom 0.305: Q9.3 47.22,70.97 47.22,70.13 49.45,67.89 49.45,63.7 Q8.1 49.45,63.42 48.62,63.42 47.5,62.31 38.84,62.31 28.78,72.36 22.35,72.36 21.51,73.2 21.51,76 | 41.91,77.67 40.79,77.67 38.84,79.63 27.1,79.63 23.47,76 21.51,76 | 21.51,76 20.4,76 17.88,78.51 D8.C | 41.91,77.67 44.42,80.19 73.48,80.19 74.88,78.79 79.07,78.79 J1.2 | 41.91,77.67 D5.A
N$48
  Bottom 0.305: Q7.2 13.97,71.81 10.9,71.81 2.79,79.91 R31.1
N$49
  Bottom 0.305: Q6.2 22.91,52.81 26.54,52.81 28.22,54.48 R30.1